# Altium schematic sheet STM32WL_LHCbit.SchDoc: Prototipo Medidor Sem Fio
size A3; SheetNumber: 3
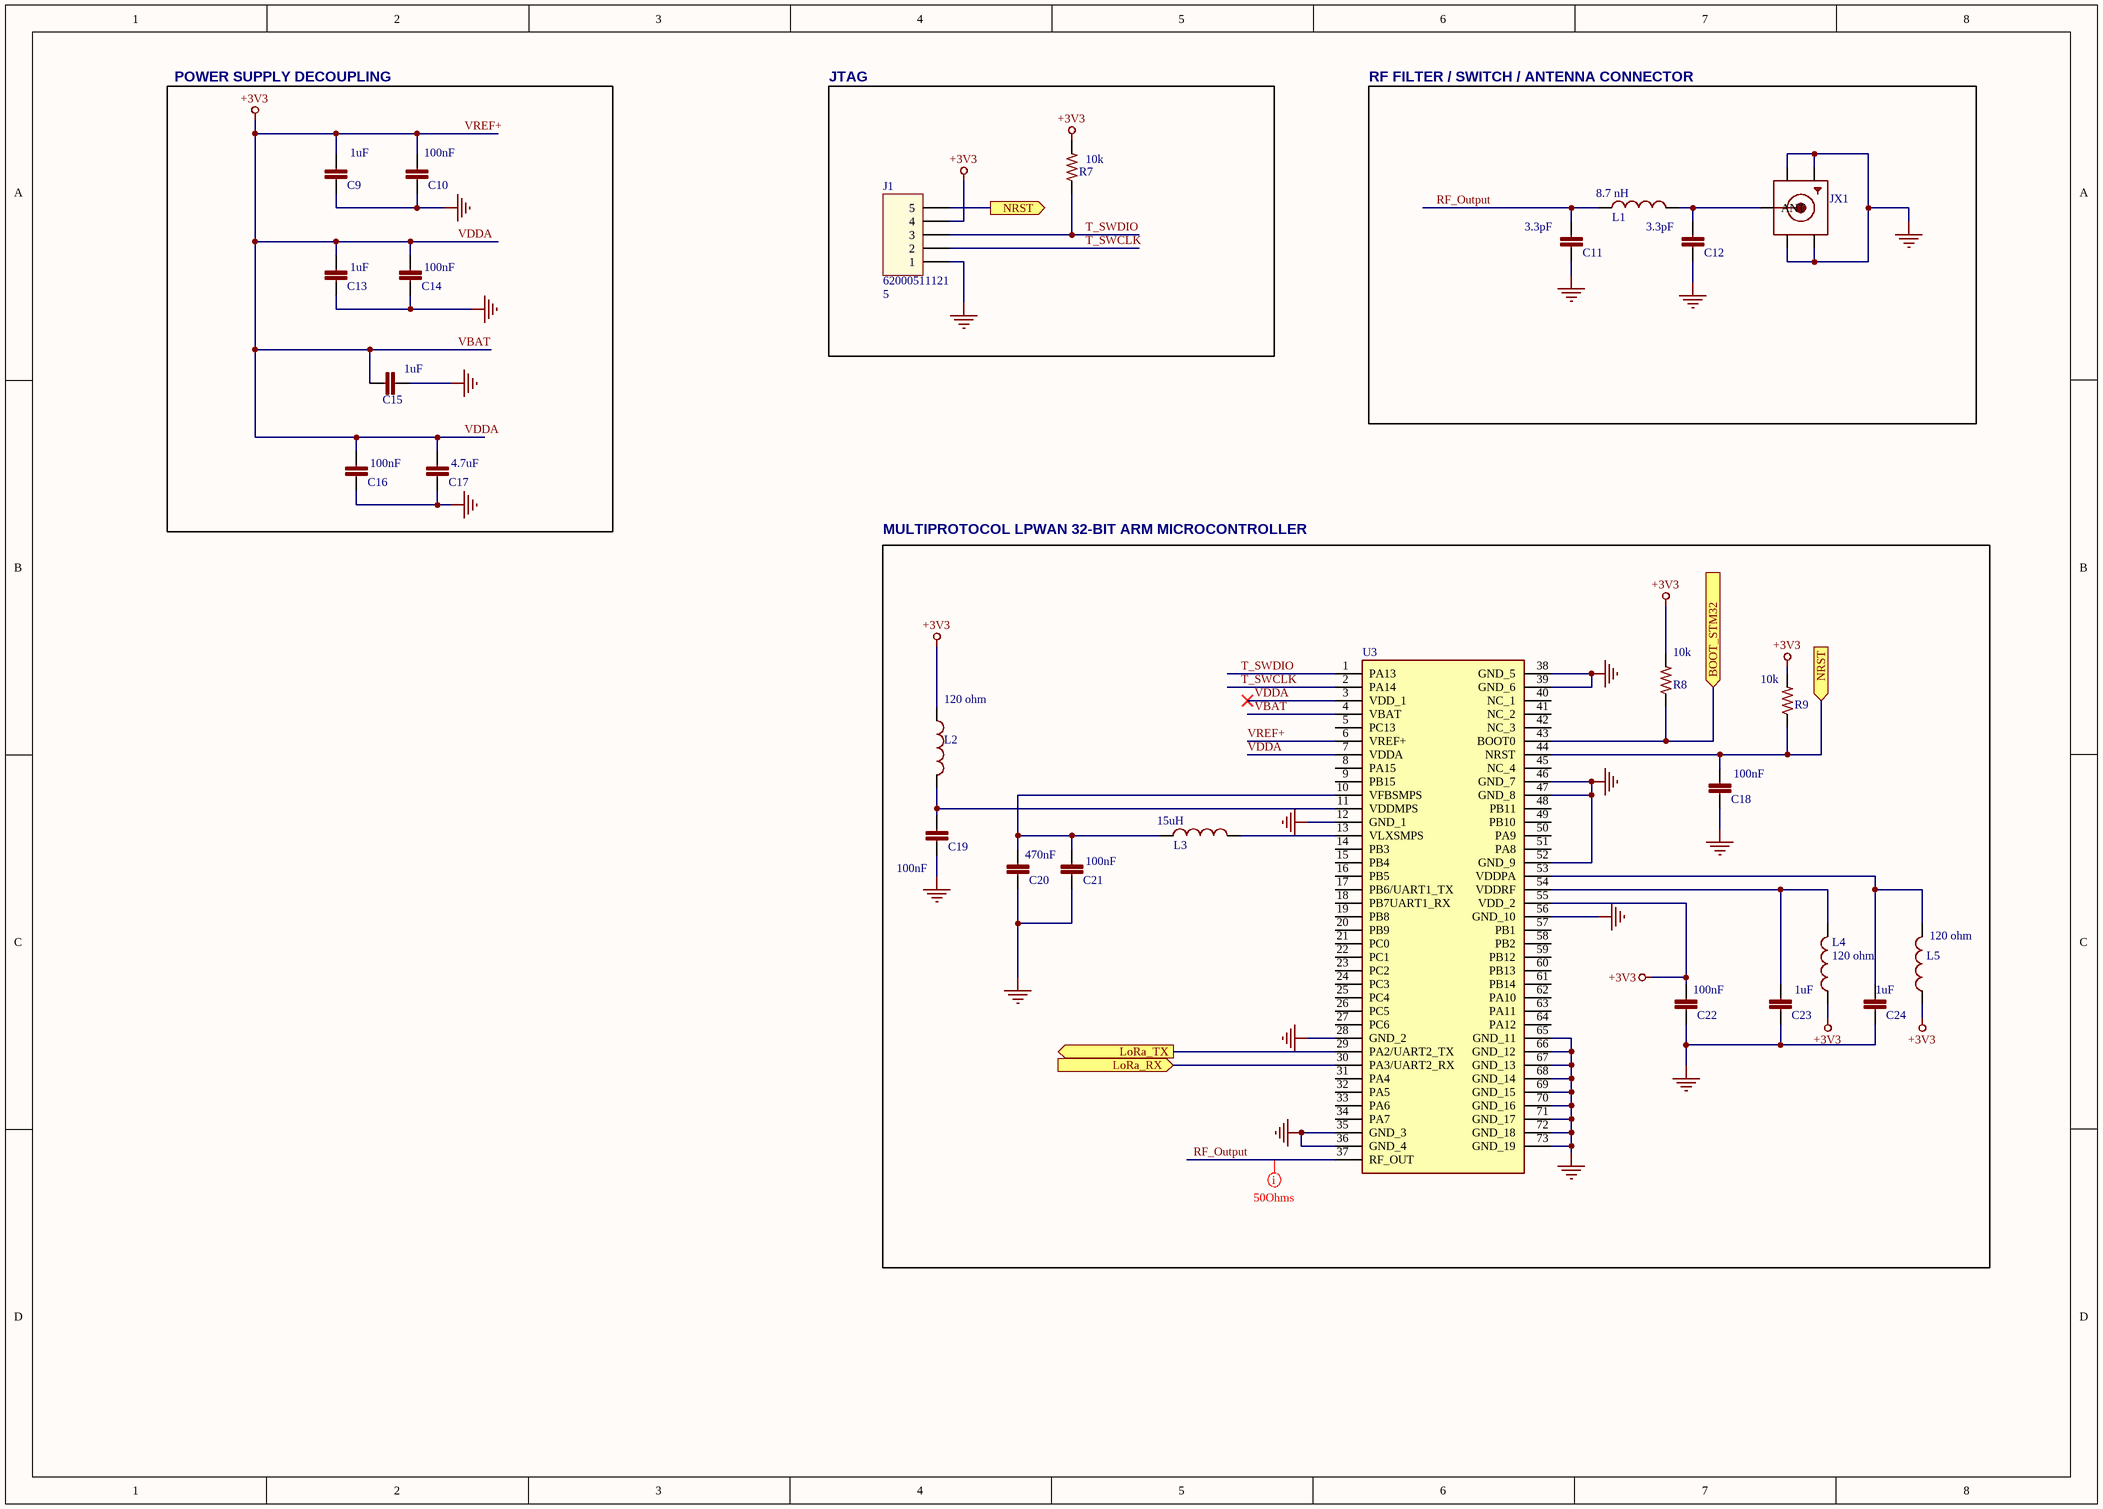
[diagram p0: STM32WL_LHCbit.SchDoc]

## Parts
C9  value 1uF  [C0402]  (hidden comment: C-EUC0402)
C10  value 100nF  [C0402]  (hidden comment: C-EUC0402)
C11  value 3.3pF  [C0402]  (hidden comment: C-EUC0402)  (no BOM)
C12  value 3.3pF  [C0402]  (hidden comment: C-EUC0402)  (no BOM)
C13  value 1uF  [C0402]  (hidden comment: C-EUC0402)
C14  value 100nF  [C0402]  (hidden comment: C-EUC0402)
C15  value 1uF  [C0402]  (hidden comment: C-EUC0402)
C16  value 100nF  [C0402]  (hidden comment: C-EUC0402)
C17  value 4.7uF  [C0402]  (hidden comment: C-EUC0402)
C18  value 100nF  [C0402]  (hidden comment: C-EUC0402)
C19  value 100nF  [C0402]  (hidden comment: C-EUC0402)
C20  value 470nF  [C0402]  (hidden comment: C-EUC0402)
C21  value 100nF  [C0402]  (hidden comment: C-EUC0402)
C22  value 100nF  [C0402]  (hidden comment: C-EUC0402)
C23  value 1uF  [C0402]  (hidden comment: C-EUC0402)
C24  value 1uF  [C0402]  (hidden comment: C-EUC0402)
J1  62000511121  value 5  [62000511121]  (no BOM)
JX1  SMACONNECTOR_EDGE_UFL  [SMA_EDGELAUNCH_UFL]  (value not drawn)
L1  value 8.7 nH  [L0402 - rounded]  (hidden comment: Ferrite bead 0402)
L2  value 120 ohm  [L0603]  (hidden comment: Ferrite bead 0603)
L3  value 15uH  [L0805]
L4  value 120 ohm  [L0603]  (hidden comment: Ferrite bead 0603)
L5  value 120 ohm  [L0603]  (hidden comment: Ferrite bead 0603)
R7  value 10k  [R0402]  (hidden comment: R-US_R0402)
R8  value 10k  [R0402]  (hidden comment: R-US_R0402)
R9  value 10k  [R0402]  (hidden comment: R-US_R0402)
U3  RAK3172-SiP  [RAK3172SiP]  (value not drawn)

## Blocks framed on the sheet
POWER SUPPLY DECOUPLING: C9 C10 C13-C17
JTAG: J1 R7
RF FILTER / SWITCH / ANTENNA CONNECTOR: C11 C12 JX1 L1
MULTIPROTOCOL LPWAN 32-BIT ARM MICROCONTROLLER: C18-C24 L2-L5 R8 R9 U3

## Ports
BOOT_STM32 (in), LoRa_RX (in), LoRa_TX (out), NRST (in), NRST (out)

## Nets
GND: C9.2 C10.2 C11.1 C12.1 C13.2 C14.2 C15.2 C16.2 C17.2 C18.2 C19.2 C20.2 C21.2 C22.2 C23.2 C24.2 J1.1 JX1.GND@1(GND1) JX1.GND@2(GND2) JX1.GND@3(GND3) JX1.GND@4(GND4) U3.12(GND_1) U3.28(GND_2) U3.35(GND_3) U3.36(GND_4) U3.38(GND_5) U3.39(GND_6) U3.46(GND_7) U3.47(GND_8) U3.52(GND_9) U3.56(GND_10) U3.65(GND_11) U3.66(GND_12) U3.67(GND_13) U3.68(GND_14) U3.69(GND_15) U3.70(GND_16) U3.71(GND_17) U3.72(GND_18) U3.73(GND_19)
VBAT: C9.1 C10.1 C13.1 C14.1 C15.1 C16.1 C17.1 C22.1 J1.4 L2.1 L4.1 L5.1 R7.2 R8.2 R9.2 U3.3(VDD_1) U3.4(VBAT) U3.6(VREF+) U3.7(VDDA) U3.55(VDD_2)  [also labelled +3V3, VDDA, VREF+]
BOOT_STM32: R8.1 U3.43(BOOT0) ; port BOOT_STM32
LoRa_RX: U3.30(PA3/UART2_RX) ; port LoRa_RX
LoRa_TX: U3.29(PA2/UART2_TX) ; port LoRa_TX
NRST: C18.1 J1.5 R9.1 U3.44(NRST) ; port NRST
RF_Output: C11.2 L1.1 U3.37(RF_OUT)
T_SWCLK: J1.2 U3.2(PA14)
T_SWDIO: J1.3 R7.1 U3.1(PA13)
NetC12_2: C12.2 JX1.P(ANT) L1.2
NetC19_1: C19.1 L2.2 U3.11(VDDMPS)
NetC20_1: C20.1 C21.1 L3.1 U3.10(VFBSMPS)
NetC23_1: C23.1 L4.2 U3.54(VDDRF)
NetC24_1: C24.1 L5.2 U3.53(VDDPA)
NetL3_2: L3.2 U3.13(VLXSMPS)

Not connected (* = marked no-connect by the designer): U3 5(PC13) 8(PA15) 9(PB15) 14(PB3) 15(PB4) 16(PB5) 17(PB6/UART1_TX) 18(PB7UART1_RX) 19(PB8) 20(PB9) 21(PC0) 22(PC1) 23(PC2) 24(PC3) 25(PC4) 26(PC5) 27(PC6) 31(PA4) 32(PA5) 33(PA6) 34(PA7) 40(NC_1) 41(NC_2) 42(NC_3) 45(NC_4) 48(PB11) 49(PB10) 50(PA9) 51(PA8) 57(PB1) 58(PB2) 59(PB12) 60(PB13) 61(PB14) 62(PA10) 63(PA11) 64(PA12)

## Layout directives
net class 50Ohms: RF_Output

## Library data of the parts
C9 C13 C15 C23 C24 = C-EUC0402: Part Number: CL05A105KA5NQNC; Vendor: Samsung; Família: Capacitor
C10 C14 C16 C18 C19 C21 C22 = C-EUC0402: Part Number: C0402C104K8; Vendor: KEMET; Família: Capacitor
C11 C12 = C-EUC0402: Part Number: GRM1555C1H3R3WA01D; Vendor: Murata; Família: Capacitor
C17 = C-EUC0402: Part Number: CL05A475MQ5NRNC; Vendor: Samsung; Família: Capacitor
C20 = C-EUC0402: Part Number: GRM155R61H474KE11D; Vendor: Murata; Família: Capacitor
J1 = 62000511121: WR-PHD 2.00 mm THT Pin Header, 6p; Vendor: Wurth Elektronik; Família: Connector; Part Number: 62000511121
JX1 = SMACONNECTOR_EDGE_UFL: Part Number: SMA-J-P-H-ST-EM1; Vendor: SAMTECH; Família: Connector
L1 = L-US0402: Part Number: LQW15AN8N7G00D; Vendor: Murata; Família: Inductor
L2 L4 L5 = L-US0603: Part Number: YI160808U121-2R5T; Vendor: YJYCOIN; Família: Inductor
L3 = L-US0805: Part Number: MLZ2012M150WTD25; Vendor: TDK; Família: Inductor
R7-R9 = R-US_R0402: Part Number: RC0402FR-0710KL; Vendor: YAGEO; Família: Resistor
U3 = RAK3172-SiP: Integrated Circuit; Part Number: RAK3172-SIP-9-SM-NI; Família: IC; Vendor: RAK